# Altium schematic sheet eGAN-FET-module_Amplifier.SchDoc
size 594 x 420 mm; SheetNumber: 2; Format: A2
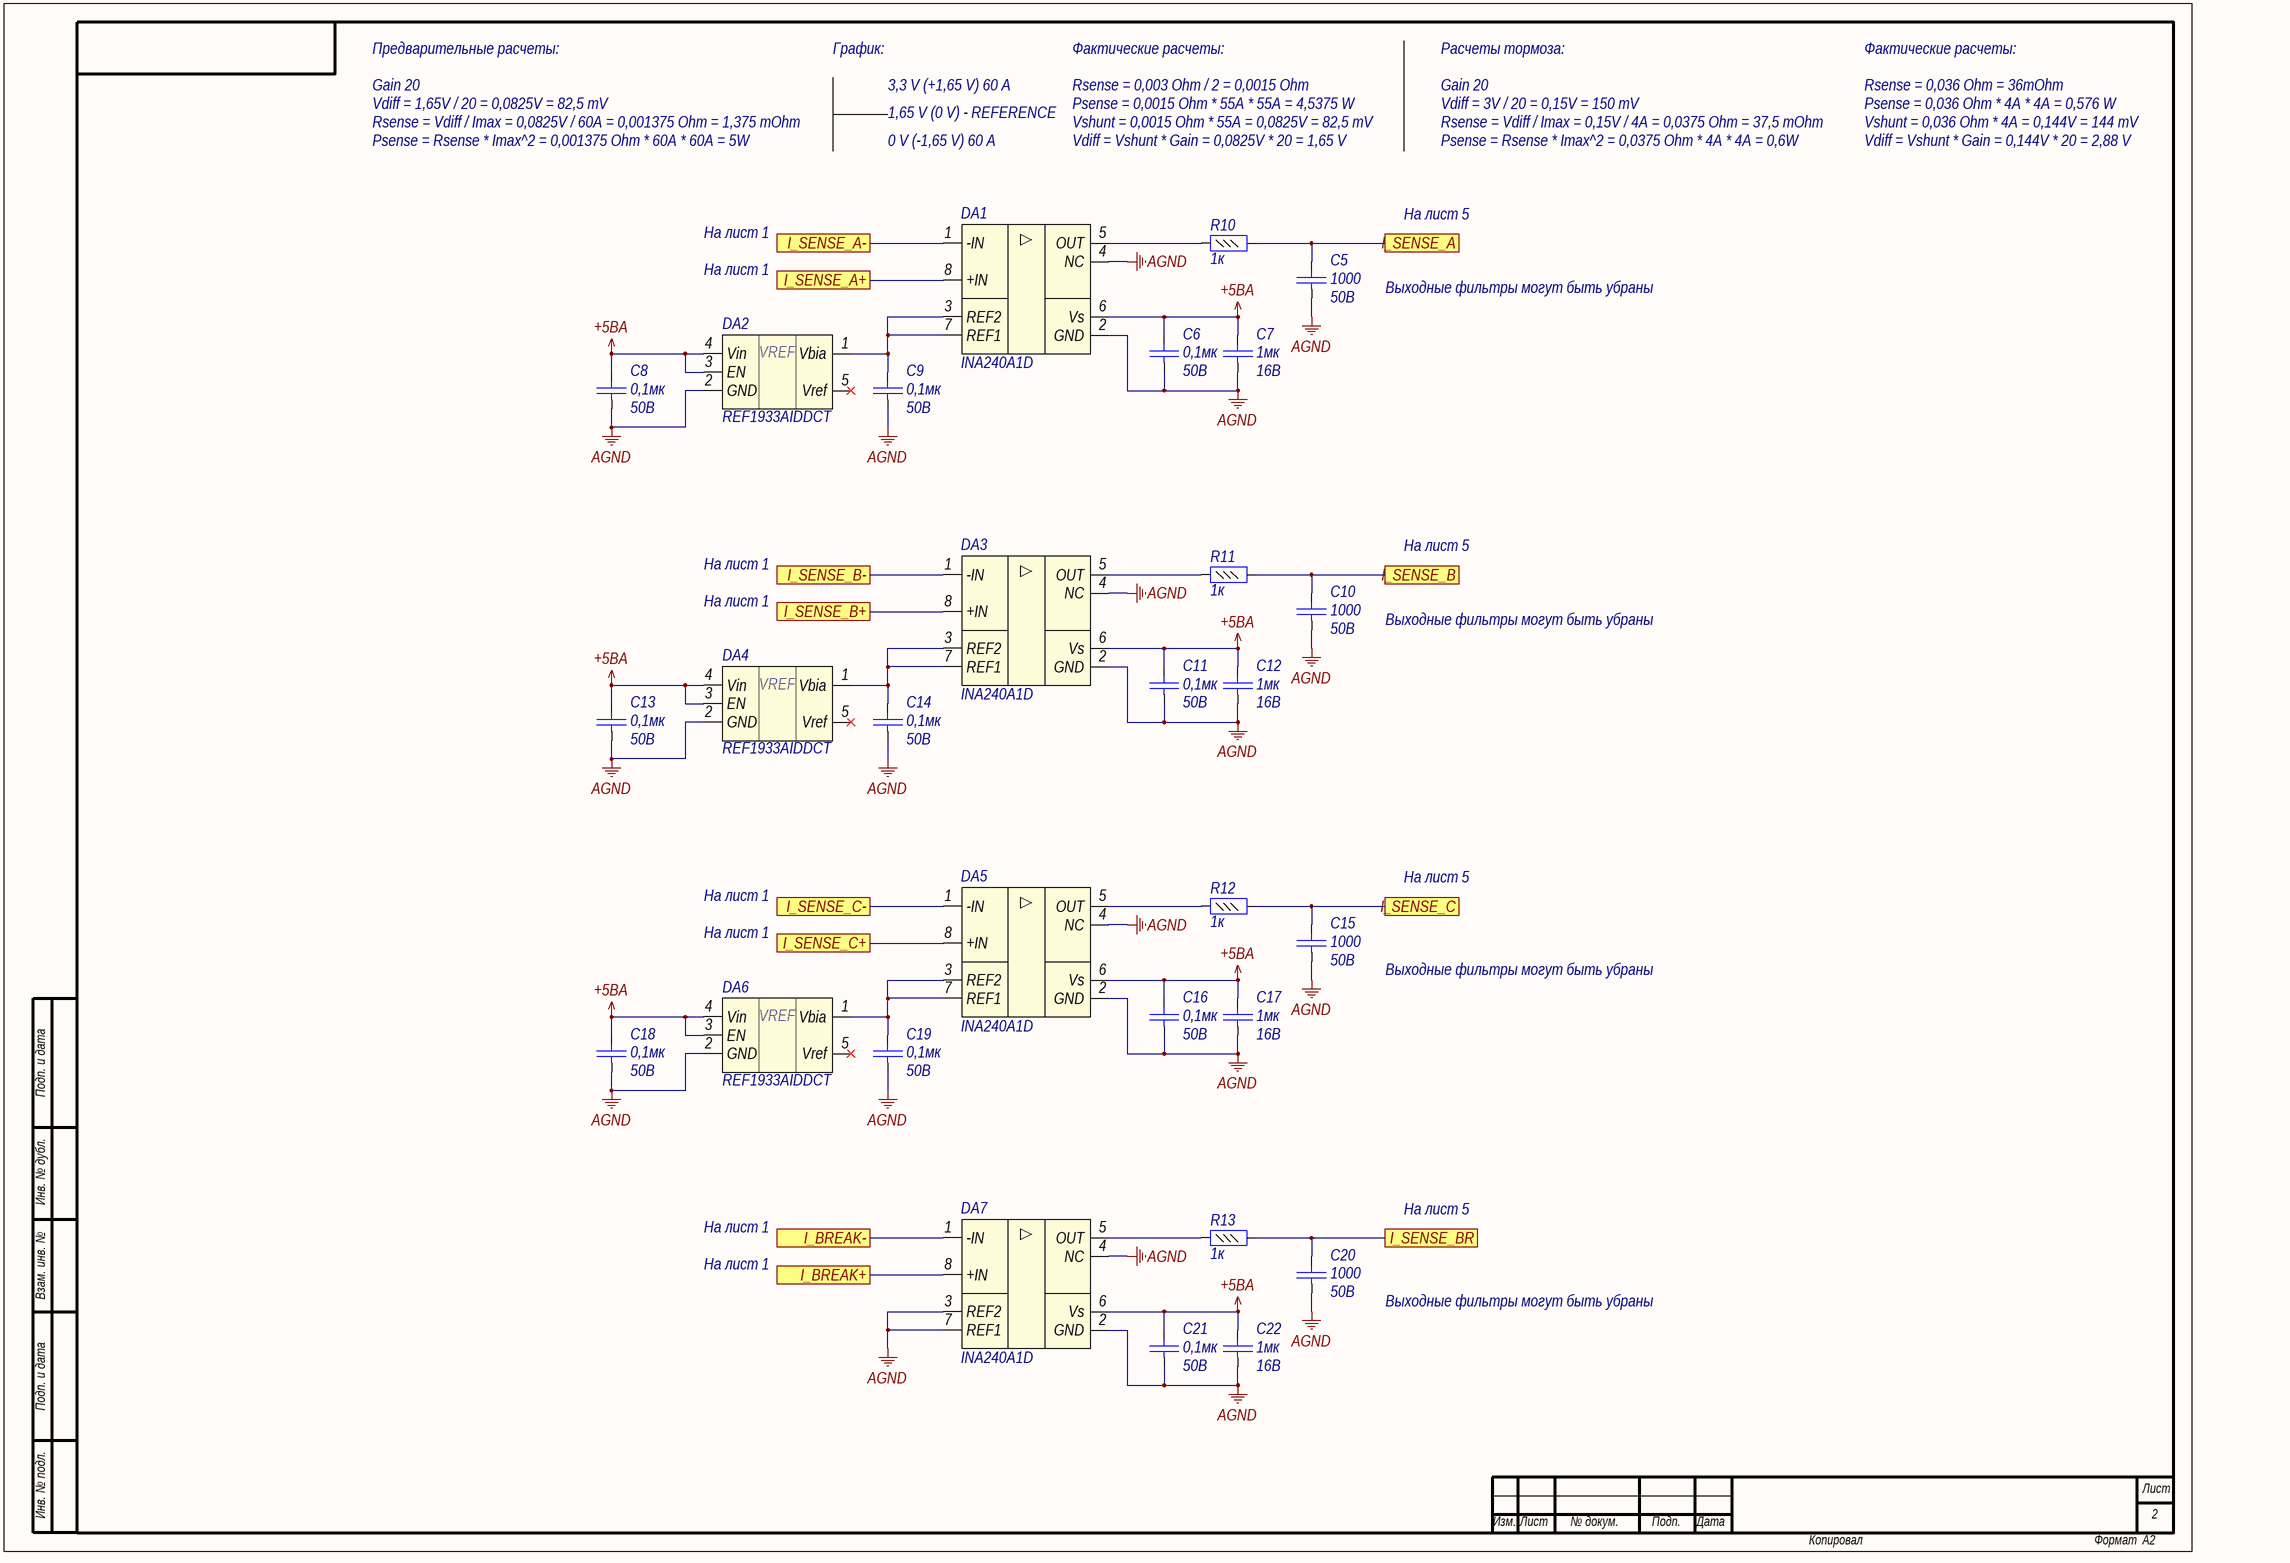
[diagram p0: eGAN-FET-module_Amplifier.SchDoc]

## Parts
C5  value 1000  Voltage: 50B  [C0402]  (hidden comment: Capacitor)
C6  value 0,1мк  Voltage: 50В  [C0402]  (hidden comment: Capacitor)
C7  Voltage: 16B  [C0402]  (hidden comment: 1мк)
C8  value 0,1мк  Voltage: 50В  [C0402]  (hidden comment: Capacitor)
C9  value 0,1мк  Voltage: 50В  [C0402]  (hidden comment: Capacitor)
C10  value 1000  Voltage: 50B  [C0402]  (hidden comment: Capacitor)
C11  value 0,1мк  Voltage: 50В  [C0402]  (hidden comment: Capacitor)
C12  Voltage: 16B  [C0402]  (hidden comment: 1мк)
C13  value 0,1мк  Voltage: 50В  [C0402]  (hidden comment: Capacitor)
C14  value 0,1мк  Voltage: 50В  [C0402]  (hidden comment: Capacitor)
C15  value 1000  Voltage: 50B  [C0402]  (hidden comment: Capacitor)
C16  value 0,1мк  Voltage: 50В  [C0402]  (hidden comment: Capacitor)
C17  Voltage: 16B  [C0402]  (hidden comment: 1мк)
C18  value 0,1мк  Voltage: 50В  [C0402]  (hidden comment: Capacitor)
C19  value 0,1мк  Voltage: 50В  [C0402]  (hidden comment: Capacitor)
C20  value 1000  Voltage: 50B  [C0402]  (hidden comment: Capacitor)
C21  value 0,1мк  Voltage: 50В  [C0402]  (hidden comment: Capacitor)
C22  Voltage: 16B  [C0402]  (hidden comment: 1мк)
DA1  INA240A1D  [SO8]
DA2  REF1933AIDDCT  [SOT23-5]
DA3  INA240A1D  [SO8]
DA4  REF1933AIDDCT  [SOT23-5]
DA5  INA240A1D  [SO8]
DA6  REF1933AIDDCT  [SOT23-5]
DA7  INA240A1D  [SO8]
R10  value 1к  [R0402]  (hidden comment: Resistor_0,062Вт)
R11  value 1к  [R0402]  (hidden comment: Resistor_0,062Вт)
R12  value 1к  [R0402]  (hidden comment: Resistor_0,062Вт)
R13  value 1к  [R0402]  (hidden comment: Resistor_0,062Вт)

## Ports
I_BREAK+, I_BREAK-, I_SENSE_A, I_SENSE_A+, I_SENSE_A-, I_SENSE_B, I_SENSE_B+, I_SENSE_B-, I_SENSE_BR, I_SENSE_C, I_SENSE_C+, I_SENSE_C-

## Nets
+5BA: C6.2 C7.2 C8.2 C11.2 C12.2 C13.2 C16.2 C17.2 C18.2 C21.2 C22.2 DA1.6(Vs) DA2.3(EN) DA2.4(Vin) DA3.6(Vs) DA4.3(EN) DA4.4(Vin) DA5.6(Vs) DA6.3(EN) DA6.4(Vin) DA7.6(Vs)
AGND: C5.1 C6.1 C7.1 C8.1 C9.1 C10.1 C11.1 C12.1 C13.1 C14.1 C15.1 C16.1 C17.1 C18.1 C19.1 C20.1 C21.1 C22.1 DA1.2(GND) DA1.4(NC) DA2.2(GND) DA3.2(GND) DA3.4(NC) DA4.2(GND) DA5.2(GND) DA5.4(NC) DA6.2(GND) DA7.2(GND) DA7.3(REF2) DA7.4(NC) DA7.7(REF1)
I_BREAK+: DA7.8(+IN) ; port I_BREAK+
I_BREAK-: DA7.1(-IN) ; port I_BREAK-
I_SENSE_A: C5.2 R10.2 ; port I_SENSE_A
I_SENSE_A+: DA1.8(+IN) ; port I_SENSE_A+
I_SENSE_A-: DA1.1(-IN) ; port I_SENSE_A-
I_SENSE_B: C10.2 R11.2 ; port I_SENSE_B
I_SENSE_B+: DA3.8(+IN) ; port I_SENSE_B+
I_SENSE_B-: DA3.1(-IN) ; port I_SENSE_B-
I_SENSE_BR: C20.2 R13.2 ; port I_SENSE_BR
I_SENSE_C: C15.2 R12.2 ; port I_SENSE_C
I_SENSE_C+: DA5.8(+IN) ; port I_SENSE_C+
I_SENSE_C-: DA5.1(-IN) ; port I_SENSE_C-
NetC9_2: C9.2 DA1.3(REF2) DA1.7(REF1) DA2.1(Vbia)
NetC14_2: C14.2 DA3.3(REF2) DA3.7(REF1) DA4.1(Vbia)
NetC19_2: C19.2 DA5.3(REF2) DA5.7(REF1) DA6.1(Vbia)
NetDA1_5: DA1.5(OUT) R10.1
NetDA3_5: DA3.5(OUT) R11.1
NetDA5_5: DA5.5(OUT) R12.1
NetDA7_5: DA7.5(OUT) R13.1

Not connected (* = marked no-connect by the designer): DA2 5(Vref)*; DA4 5(Vref)*; DA6 5(Vref)*

## Notes on the sheet
- Предварительные расчеты:
- График:
- Фактические расчеты:
- Расчеты тормоза:
- Gain 20
- Vdiff = 1,65V / 20 = 0,0825V = 82,5 mV
- 3,3 V (+1,65 V) 60 A
- 1,65 V (0 V) - REFERENCE
- Rsense = 0,003 Ohm / 2 = 0,0015 Ohm
- Psense = 0,0015 Ohm * 55A * 55A = 4,5375 W
- Vdiff = 3V / 20 = 0,15V = 150 mV
- Rsense = 0,036 Ohm = 36mOhm
- Psense = 0,036 Ohm * 4A * 4A = 0,576 W
- Rsense = Vdiff / Imax = 0,0825V / 60A = 0,001375 Ohm = 1,375 mOhm
- Psense = Rsense * Imax^2 = 0,001375 Ohm * 60A * 60A = 5W
- 0 V (-1,65 V) 60 A
- Vshunt = 0,0015 Ohm * 55A = 0,0825V = 82,5 mV
- Vdiff = Vshunt * Gain = 0,0825V * 20 = 1,65 V
- Rsense = Vdiff / Imax = 0,15V / 4A = 0,0375 Ohm = 37,5 mOhm
- Psense = Rsense * Imax^2 = 0,0375 Ohm * 4A * 4A = 0,6W
- Vshunt = 0,036 Ohm * 4A = 0,144V = 144 mV
- Vdiff = Vshunt * Gain = 0,144V * 20 = 2,88 V
- На лист 1
- На лист 5
- Выходные фильтры могут быть убраны
- Подп. и дата
- Инв. № дубл.
- Взам. инв. №
- Инв. № подл.
- Лист
- Изм.
- № докум.
- Подп.
- Дата
- Копировал
- Формат
- (in symbol REF1933AIDDCT) VREF

## Library data of the parts
C5 C10 C15 C20 = cap28: Конденсатор; Part Name: Ceramic; Manufacture: Murata; Part Number: GRM1555C1H102J; id: cap28; TKE: NP0
C6 C8 C9 C11 C13 C14 C16 C18 C19 C21 = cap277: Конденсатор; Part Name: Ceramic; Manufacture: Murata; Part Number: GRM155R71H104KE14D; id: cap277; TKE: X7R; tga: 0,10%
C7 C12 C17 C22 = cap358: Конденсатор; Part Name: MLCC; Manufacture: Taiyo Yuden; Part Number: EMK105BJ105KV-F; id: cap358; TKE: X5R; tga: 0.10%; Value: 1мк; Temperature: -55°C…+85°C
DA1 DA3 DA5 DA7 = amp29: –4-V to 80-V, Bidirectional, Ultra-Precise Current Sense Amplifier With / Enhanced PWM Rejection; Manufacture: Texas Instruments; id: amp29; Supply Voltage: 2,7-5,5B; Quiescent curent: 2,6mA; Bandwidth: 400kHz; Gain: 20; Input Bias Current: 90uA; CMRR: 132dB; Channels: 1; Part Name: Bidirectional, Ultra-Precise Current Sense Amplifier; Rail-to-rail: -; PSRR: 132dB; Temperature: -55...150°C; Part Number: INA240A1D
DA2 DA4 DA6 = REF1933AIDDCT: , Dual-Output, VREF and VREF / 2 Voltage References; Part Name: Low-Drift, Low-Power, Dual-Output, Voltage References; Manufacturer: Texas Instruments; id: ref5; Voltage min stabilize: 3,3B/1,65B; Max input voltage: 5,5B; Accuracy: 0.001; Working current: 430uA; Output current: 20mA; Part Number: REF1933AIDDCT
R10-R13 = res270: Резистор; Manufacture: Yageo; Part Number: RC0402FR-071KL; id: res270; Accuracy: 0,01; Part Name: Resistor; Power: 0,062Вт